# Altium schematic sheet can-面板.SchDoc
size A4
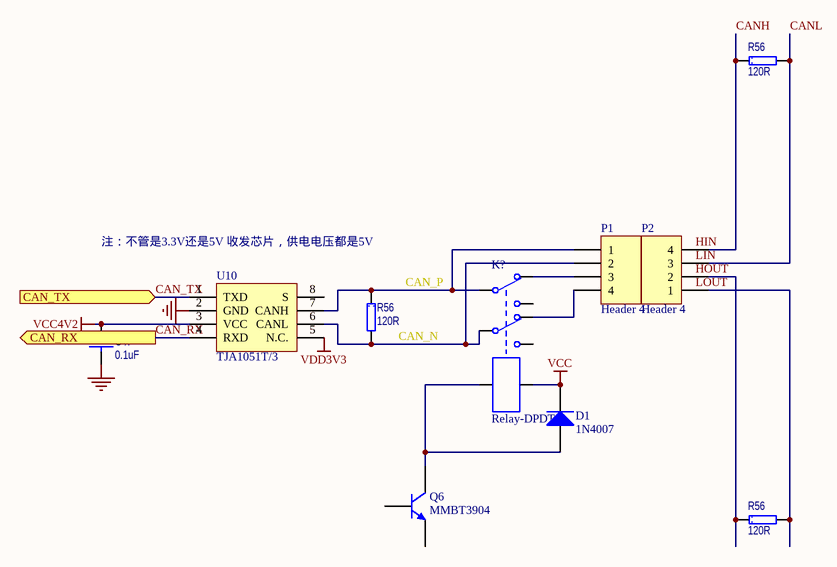
[diagram p0: can-面板.SchDoc]

## Parts
(Parts that share a designator on the sheet are numbered #1, #2 ... from top to bottom, then left to right.)
C47  0.1uF  [2012[0805]06CD]
D1  1N4007  [DO-214AC/SMA]
K?  Relay-DPDT  [DIP-P8/E10]
P1  Header 4  [HDR1X4]
P2  Header 4  [HDR1X4]
Q6  MMBT3904  [SOT23_N]
R56#1  120R  [2012[0805]R]
R56#2  120R  [2012[0805]R]
R56#3  120R  [2012[0805]R]
U10  TJA1051T/3  [SOIC8_N]

## Ports
CAN_RX (out), CAN_TX (in)

## Nets
GND: C47.2 U10.2(GND)
VCC: D1.2(K) K?.8
VCC4V2: C47.1 U10.3(VCC)
VDD3V3: U10.5(N.C.)
CAN_N: K?.4 P1.2 R56#2.2 U10.6(CANL)
CAN_P: K?.1 P1.1 R56#2.1 U10.7(CANH)
CAN_RX: U10.4(RXD) ; port CAN_RX
CAN_TX: U10.1(TXD) ; port CAN_TX
CANH: P2.4 R56#1.1
CANL: P2.3 R56#1.2
NetD1_1: D1.1(A) K?.7 Q6.3(C)
NetK?_2: K?.2 P1.3
NetK?_5: K?.5 P1.4
NetP2_1: P2.1 R56#3.2
NetP2_2: P2.2 R56#3.1

Not connected (* = marked no-connect by the designer): K? 3 6; Q6 1(B) 2(E); U10 8(S)

## Notes on the sheet
- (near U10) 注：不管是3.3V还是5V 收发芯片，供电电压都是5V
- Labels drawn without touching a wire or pin: HIN, HOUT, LIN, LOUT

## Library data of the parts
C47 = CAP: Capacitor; Manufacturer: TDK; Type: 无铅电容; Model: C0603X7R1H104K; Value: 0.1uF
D1 = 1N4007: 1.0 Ampere General Purpose Rectifier; Published: 8-Jun-2000; LatestRevisionDate: 17-Jul-2002; LatestRevisionNote: Re-released for DXP Platform.; DatasheetDocument: 1998; PackageDocument: Aug-1999; PackageReference: DO-41; Publisher: Altium Limited; Code_JEDEC: DO-204-AL; ComponentLink1Description: Manufacturer Link; ComponentLink1URL: http://www.fairchildsemi.com/; ComponentLink2Description: Pinout Specification; ComponentLink2URL: http://www.fairchildsemi.com/ds/1N%2F1N4001.pdf
K? = Relay-DPDT: Dual-Pole Dual-Throw Relay; Published: 24-Mar-1999; LatestRevisionDate: 17-Jul-2002; LatestRevisionNote: Re-released for DXP Platform.; PackageReference: DIP-P8; Publisher: Altium Limited
P1 P2 = Header 4: Header, 4-Pin; LatestRevisionDate: 17-Jul-2002; LatestRevisionNote: Re-released for DXP Platform.; Publisher: Altium Limited
Q6 = MMBT3904: NPN Switching Transistor; Published: 17-Sep-2003; LatestRevisionDate: 12-Dec-2006; LatestRevisionNote: IPC-7351 Footprint Added.; DatasheetVersion: 13-May-2002; PackageVersion: May-1999; PackageReference: SOT23; Publisher: Altium Limited; PackageDescription: 3-Pin SOT-23 Package 0.95 mm Pitch, 2.3 mm Lead Span; ComponentLink1Description: Manufacturer Link; ComponentLink1URL: http://www.semiconductors.philips.com/; ComponentLink2Description: Datasheet; ComponentLink2URL: http://www.semiconductors.philips.com/acrobat/datasheets/MMBT3904_4.pdf
R56#1-R56#3 = RES: Manufacturer: vishay; Model: RT0603DRD7D120RL; Value: 120R; Type: 无铅电阻
U10 = TJA1051T/3: IC; 公司: NXP